# EAGLE schematic Reciever_11-16 (EAGLE 8.4.0)
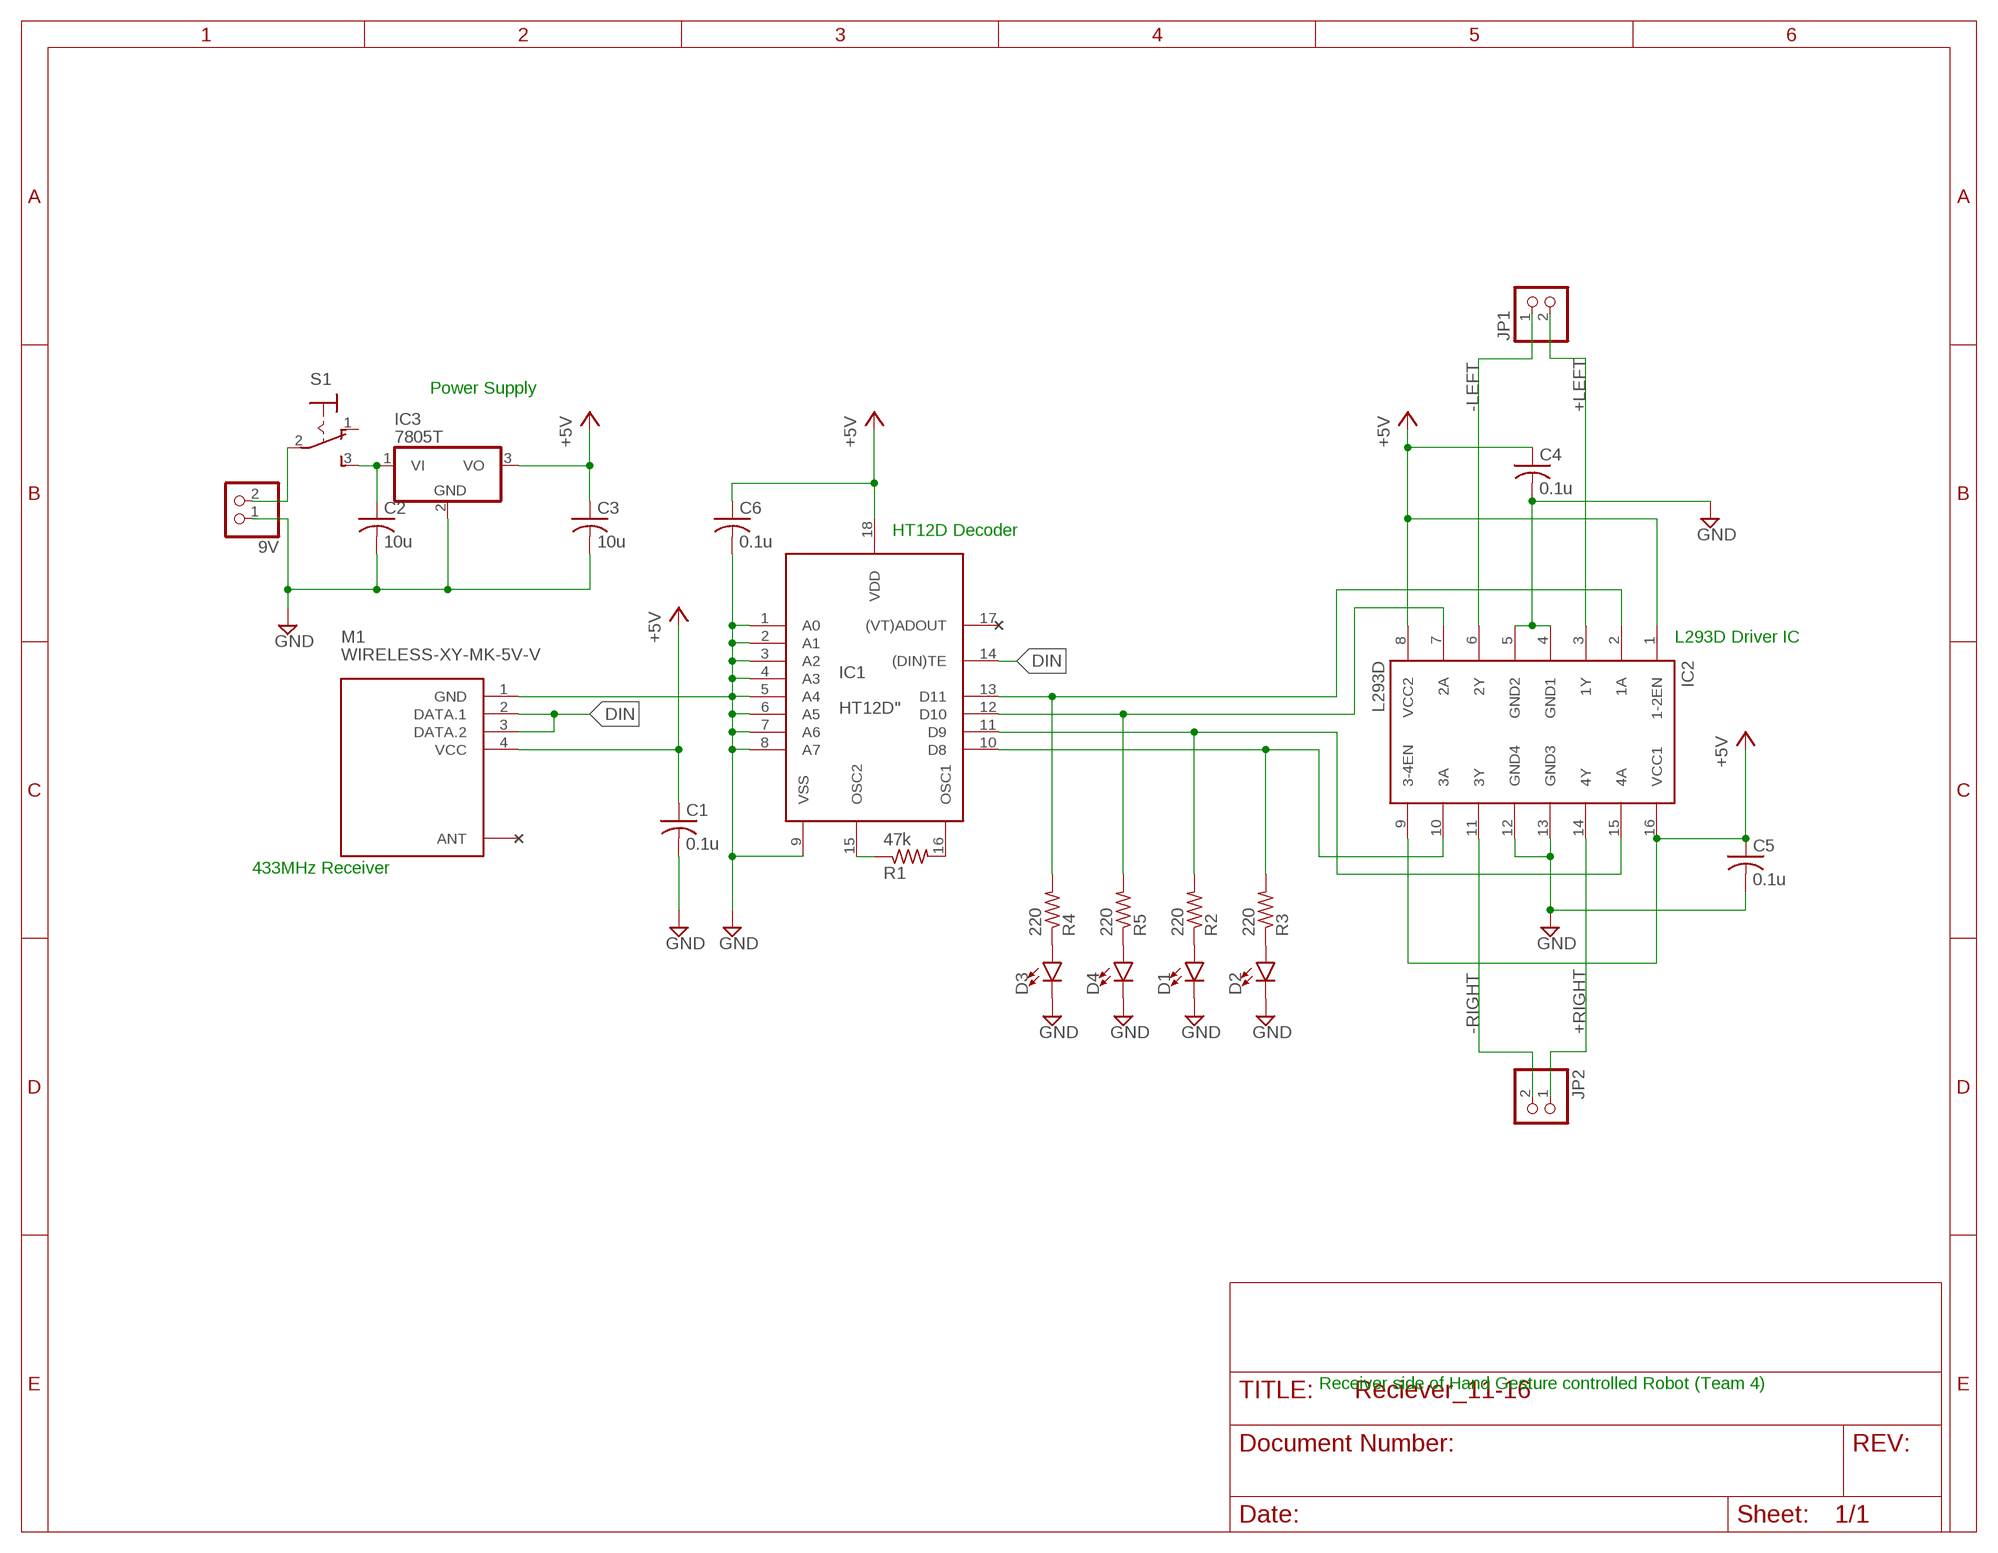
[diagram p0: schematic, sheet 1]

## Parts
9V  PINHD-1X2  [1X02]
C1  0.1u  C-USC0805  [C0805]
C2  10u  C-USC0805  [C0805]
C3  10u  C-USC0805  [C0805]
C4  0.1u  C-USC0805  [C0805]
C5  0.1u  C-USC0805  [C0805]
C6  0.1u  C-USC0805  [C0805]
D1  LED3MM  [LED_3MM]
D2  LED3MM  [LED_3MM]
D3  LED3MM  [LED_3MM]
D4  LED3MM  [LED_3MM]
IC1  HT12D"  [18-DIP-A]
IC2  L293D  [DIL16]
IC3  7805T  [TO220H]
JP1  PINHD-1X2  [1X02]
JP2  PINHD-1X2  [1X02]
M1  WIRELESS-XY-MK-5V-V  [WIRELESS-XY-MK-5V#V]
R1  47k  R-US_R0805  [R0805]
R2  220  R-US_R0805  [R0805]
R3  220  R-US_R0805  [R0805]
R4  220  R-US_R0805  [R0805]
R5  220  R-US_R0805  [R0805]
S1  M9040P  [M9040P]

## Nets
+5V [+5V]: C1.1 C3.1 C4.1 C5.1 C6.1 IC1.18(VDD) IC2.1(1-2EN) IC2.8(VCC2) IC2.9(3-4EN) IC2.16(VCC1) IC3.3(VO) M1.4(VCC)
+LEFT [Motor]: IC2.3(1Y) JP1.2
+RIGHT [Motor]: IC2.14(4Y) JP2.1
-LEFT [Motor]: IC2.6(2Y) JP1.1
-RIGHT [Motor]: IC2.11(3Y) JP2.2
DIN: IC1.14((DIN)TE) M1.2(DATA.1) M1.3(DATA.2)
GND: 9V.1 C1.2 C2.2 C3.2 C4.2 C5.2 C6.2 D1.K(C) D2.K(C) D3.K(C) D4.K(C) IC1.1(A0) IC1.2(A1) IC1.3(A2) IC1.4(A3) IC1.5(A4) IC1.6(A5) IC1.7(A6) IC1.8(A7) IC1.9(VSS) IC2.4(GND1) IC2.5(GND2) IC2.12(GND4) IC2.13(GND3) IC3.2(GND) M1.1(GND)
N$1: IC1.16(OSC1) R1.2
N$3: IC1.10(D8) IC2.10(3A) R3.2
N$4: IC1.15(OSC2) R1.1
N$5: D1.A R2.1
N$6: IC1.11(D9) IC2.15(4A) R2.2
N$7: IC1.12(D10) IC2.7(2A) R5.2
N$8: IC1.13(D11) IC2.2(1A) R4.2
N$10: 9V.2 S1.2(P)
N$13: D2.A R3.1
N$14: D3.A R4.1
N$16: D4.A R5.1
N$17: C2.1 IC3.1(VI) S1.3(S)
Unconnected: IC1.17((VT)ADOUT) M1.ANT S1.1(O)

## Notes on the sheet
- Power Supply
- HT12D Decoder
- L293D Driver IC
- 433MHz Receiver
- Receiver side of Hand Gesture controlled Robot (Team 4)

## Library data of the parts
9V JP1 JP2 = pinhead:PINHD-1X2: PIN HEADER
C1-C6 = adafruit:C-US: CAPACITOR, American symbol
D1-D4 = SparkFun-LED:LED: LED (Generic) Standard schematic elements and footprints for 5mm, 3mm, 1206, and 0603 sized LEDs. Generic LEDs with no color specified.; PROD_ID: DIO-08794
IC1 = holtek:HT12D: decoder = receiver ic
IC2 = st-microelectronics:L293D: PUSH-PULL 4 CHANNEL DRIVER; MPN: L293D; OC_FARNELL: 9589619; OC_NEWARK: 56P8249
IC3 = adafruit:78*: Positive VOLTAGE REGULATOR Added bigger pads to the TO-92 package
M1 = diy-modules:WIRELESS-XY-MK-5V: RF Wireless XY-MK-5V Receiver Click here to find device on ebay.com <http://www.ebay.com/sch/xd+rf+5v-receiver> Note: Sold together with transmitter.
R1-R5 = adafruit:R-US_: RESISTOR, American symbol
S1 = switch:M9040P: TOGGLE SWITCH Marquardt

## Net classes
0 default: width 0.178 mm, drill 0.406 mm, clearance 0.203 mm
1 +5V: width 1.27 mm, drill 0.406 mm, clearance 0.203 mm to class 0, clearance 0.203 mm
2 Motor: width 1.27 mm, drill 0.406 mm, clearance 0.203 mm to class 0, clearance 0.203 mm to class 1, clearance 0.203 mm